# Altium schematic sheet Connectors_task.SchDoc
size A
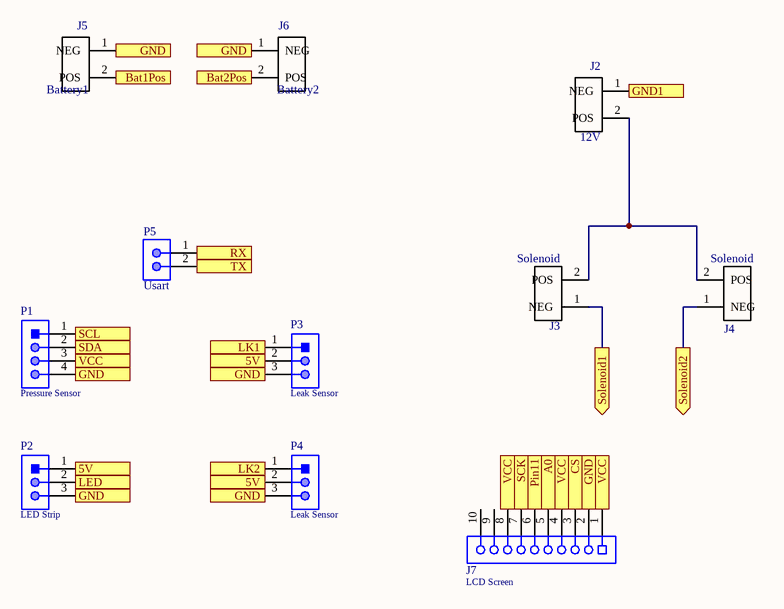
[diagram p0: Connectors_task.SchDoc]

## Parts
J2  12V  [*AMASS_XT60-M]
J3  Solenoid  [*AMASS_XT60-M]
J4  Solenoid  [*AMASS_XT60-M]
J5  Battery1  [*AMASS_XT60-M]
J6  Battery2  [*AMASS_XT60-M]
J7  LCD Screen  [61301011821]
P1  Pressure Sensor  [61900411121]
P2  LED Strip  [61900311121]
P3  Leak Sensor  [61900311121]
P4  Leak Sensor  [61900311121]
P5  Usart  [JST-B2B-EH-A_V]

## Ports
5V (in), A0 (out), Bat1Pos (out), Bat2Pos (out), CS (out), GND1 (in), GND (in), GND (out), LED (in), LK1 (out), LK2 (out), Pin11 (in), RX (out), SCK (out), SCL (in), SDA (in), Solenoid1 (out), Solenoid2 (out), TX (in), VCC (in)

## Nets
5V: P2.1 P3.2 P4.2 ; port 5V
A0: J7.5 ; port A0
Bat1Pos: J5.2(POS) ; port Bat1Pos
Bat2Pos: J6.2(POS) ; port Bat2Pos
CS: J7.3 ; port CS
GND: J5.1(NEG) J6.1(NEG) J7.2 P1.4 P2.3 P3.3 P4.3 ; port GND
GND1: J2.1(NEG) ; port GND1
LED: P2.2 ; port LED
LK1: P3.1 ; port LK1
LK2: P4.1 ; port LK2
Pin11: J7.6 ; port Pin11
RX: P5.1 ; port RX
SCK: J7.7 ; port SCK
SCL: P1.1 ; port SCL
SDA: P1.2 ; port SDA
Solenoid1: J3.1(NEG) ; port Solenoid1
Solenoid2: J4.1(NEG) ; port Solenoid2
TX: P5.2 ; port TX
VCC: J7.1 J7.4 J7.8 P1.3 ; port VCC
NetJ2_2: J2.2(POS) J3.2(POS) J4.2(POS)

Not connected (* = marked no-connect by the designer): J7 9 10

## Library data of the parts
J2-J6 = XT60-M: MF: AMASS; Availability: Unavailable; Price: None; MP: XT60-M; Package: Package Analog Devices; SnapEDA_Link: https://www.snapeda.com/parts/XT60-M/AMASS/view-part/?ref=snap; Value: *
J7 = CMP-1502-01332-1: THT Vertical Socket Header WR-PHD, Pitch 2.54 mm, Single Row, 10 pins; Manufacturer: Wurth Elektronik; Rated Current: 3A; Working Voltage: 250VAC; Gender: Female; Pitch: 2.54mm; Contact Resistance: 20mOhm; Pin Number: 10; Withstanding Voltage: 500VAC; Publisher: WurthElektronik; Orientation: Vertical; Row Number: Single; Package Reference: 61301011821; Packaging: Tray; Datasheet URL: https://katalog.we-online.de/em/datasheet/6130xx11821.pdf; Operating Temperature: -40to125degC; Part Number: 61301011821; Manufacturer URL: http://www.we-online.de; Mounting Technology: THT
P1 = CMP-1502-00586-1: Male Locking Header WR-WTB, THT, Vertical, pitch 2.54 mm, 1 x 4 position; Manufacturer: Wurth Elektronik; Working Voltage: 250VAC; Pitch: 2.54mm; Contact Resistance: 20mOhm; Position: 1x4; Publisher: WurthElektronik; Manufacturer URL: http://www.we-online.de; Datasheet URL: https://katalog.we-online.de/em/datasheet/6190xx11121.pdf; Operating Temperature: -40to105degC; Packaging: Bag; Gender: Male; Package Reference: 61900411121; Orientation: Vertical; Mounting Technology: THT; Part Number: 61900411121
P2-P4 = CMP-1502-00585-1: Male Locking Header WR-WTB, THT, Vertical, pitch 2.54 mm, 1 x 3 position; Manufacturer: Wurth Elektronik; Contact Resistance: 20mOhm; Pitch: 2.54mm; Working Voltage: 250VAC; Position: 1x3; Mounting Technology: THT; Operating Temperature: -40to105degC; Part Number: 61900311121; Datasheet URL: https://katalog.we-online.de/em/datasheet/6190xx11121.pdf; Manufacturer URL: http://www.we-online.de; Publisher: WurthElektronik; Orientation: Vertical; Gender: Male; Package Reference: 61900311121; Packaging: Bag
P5 = CMP-2000-05887-1: Male Header, Pitch 2.5 mm, 1 x 2 Position, Height 6 mm, Tail Length 3.2 mm, -25 to 85 degC, RoHS, Bulk; Manufacturer: JST; Other Names: 455-1014; Mating Products: 455-1000-ND-CONNHOUSINGEH2POS2.5MMCRIMP455-2933-ND-CONNRECEPTHR2POS2.5MMBLACK455-2934-ND-CONNRECEPTHR2POS2.5MMWHITE455-1044-ND-CONNRECEPTHR2POS2.5MMWHITE455-1057-ND-CONNRECEPTHR2POS2.5MMBLACK; Pitch: 0.098"(2.50mm); Connector Type: Header,Shrouded; Number of Positions: 2; Number of Positions Loaded: All; Manufacturer URL: http://www.jst.com/home2.html; Contact Type: MalePin; Package Description: Male Header, Pitch 2.5 mm, 1 x 2 Position, Height 6 mm, Tail Length 3.2 mm; Mounting Type: ThroughHole; Mounting Technology: ThroughHole; Number of Rows: 1; Features: -; Fastening Type: DetentLock; Contact Finish Thickness: -; Datasheet Version: 10/2002; Termination: Press-Fit; Datasheet URL: http://media.digikey.com/pdf/Data%20Sheets/JST%20PDFs/EH%20Series.pdf; Standard Package: 1,000; Category: Connectors,Interconnects; Family: RectangularConnectors-Headers,MalePins; Contact Finish: Tin-Lead; Packaging: Bulk; Color: Natural; Package Reference: B2B-EH-A; Row Spacing: -; Contact Mating Length: 0.130"(3.30mm); Series: EH